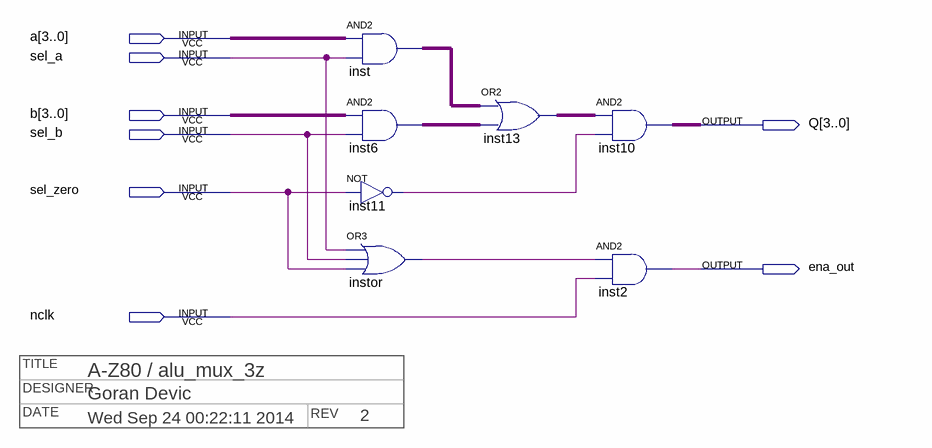
[diagram p0: schematic sheet]
// Quartus schematic alu_mux_3z.bdf as structural Verilog: 7 symbols, 8 pins
// Title block: TITLE: A-Z80 / alu_mux_3z; DESIGNER: Goran Devic; DATE: Wed Sep 24 00:22:11 2014; REV: 2
module alu_mux_3z (
  input  [3:0] a,
  input  sel_a,
  input  [3:0] b,
  input  sel_b,
  input  sel_zero,
  input  nclk,
  output [3:0] Q,
  output ena_out
);

  wire inst11_out, instor_out;
  wire [3:0] inst6_out, inst13_out, inst_out;

  assign inst_out = a & {4{sel_a}};  // AND2 inst, 4 bits wide
  assign inst6_out = b & {4{sel_b}};  // AND2 inst6, 4 bits wide
  not inst11 (inst11_out, sel_zero);
  or instor (instor_out, sel_a, sel_b, sel_zero);
  assign inst13_out = inst_out | inst6_out;  // OR2 inst13, 4 bits wide
  assign Q = inst13_out & {4{inst11_out}};  // AND2 inst10, 4 bits wide
  and inst2 (ena_out, instor_out, nclk);
endmodule
